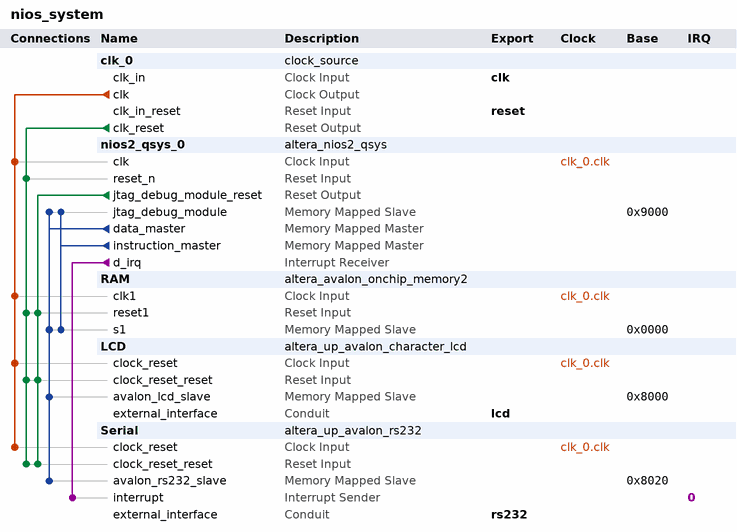
[diagram p0: system contents]
# Platform Designer (Qsys) system nios_system, Cyclone II EP2C35F672C6
# Parameters at their usual value, and those the tool derives, are not listed.
package require -exact qsys 13.0
create_system nios_system
set_project_property DEVICE_FAMILY {Cyclone II}
set_project_property DEVICE EP2C35F672C6

add_instance clk_0 clock_source 13.0
set_instance_parameter_value clk_0 clockFrequency 50000000

add_instance nios2_qsys_0 altera_nios2_qsys 13.0
set_instance_parameter_value nios2_qsys_0 resetSlave RAM.s1
set_instance_parameter_value nios2_qsys_0 mmu_TLBMissExcSlave None
set_instance_parameter_value nios2_qsys_0 exceptionSlave RAM.s1
set_instance_parameter_value nios2_qsys_0 breakSlave nios2_qsys_0.jtag_debug_module
set_instance_parameter_value nios2_qsys_0 impl Small
set_instance_parameter_value nios2_qsys_0 icache_size 4096

add_instance RAM altera_avalon_onchip_memory2 13.0.1.99.2
set_instance_parameter_value RAM dataWidth 32
set_instance_parameter_value RAM dualPort false
set_instance_parameter_value RAM initMemContent true
set_instance_parameter_value RAM initializationFileName onchip_mem.hex
set_instance_parameter_value RAM memorySize 24576

add_instance LCD altera_up_avalon_character_lcd 13.0
set_instance_parameter_value LCD cursor Normal

add_instance Serial altera_up_avalon_rs232 13.0
set_instance_parameter_value Serial baud 115200
set_instance_parameter_value Serial parity None

# connections
add_connection clk_0.clk LCD.clock_reset clock
add_connection clk_0.clk nios2_qsys_0.clk clock
add_connection clk_0.clk RAM.clk1 clock
add_connection clk_0.clk Serial.clock_reset clock
add_connection clk_0.clk_reset LCD.clock_reset_reset reset
add_connection clk_0.clk_reset nios2_qsys_0.reset_n reset
add_connection clk_0.clk_reset RAM.reset1 reset
add_connection clk_0.clk_reset Serial.clock_reset_reset reset
add_connection nios2_qsys_0.jtag_debug_module_reset LCD.clock_reset_reset reset
add_connection nios2_qsys_0.jtag_debug_module_reset RAM.reset1 reset
add_connection nios2_qsys_0.jtag_debug_module_reset Serial.clock_reset_reset reset
add_connection nios2_qsys_0.data_master LCD.avalon_lcd_slave avalon
set_connection_parameter_value nios2_qsys_0.data_master/LCD.avalon_lcd_slave baseAddress 0x8000
add_connection nios2_qsys_0.data_master nios2_qsys_0.jtag_debug_module avalon
set_connection_parameter_value nios2_qsys_0.data_master/nios2_qsys_0.jtag_debug_module baseAddress 0x9000
add_connection nios2_qsys_0.data_master RAM.s1 avalon
set_connection_parameter_value nios2_qsys_0.data_master/RAM.s1 baseAddress 0x0000
add_connection nios2_qsys_0.data_master Serial.avalon_rs232_slave avalon
set_connection_parameter_value nios2_qsys_0.data_master/Serial.avalon_rs232_slave baseAddress 0x8020
add_connection nios2_qsys_0.instruction_master nios2_qsys_0.jtag_debug_module avalon
set_connection_parameter_value nios2_qsys_0.instruction_master/nios2_qsys_0.jtag_debug_module baseAddress 0x9000
add_connection nios2_qsys_0.instruction_master RAM.s1 avalon
set_connection_parameter_value nios2_qsys_0.instruction_master/RAM.s1 baseAddress 0x0000
add_connection nios2_qsys_0.d_irq Serial.interrupt interrupt
set_connection_parameter_value nios2_qsys_0.d_irq/Serial.interrupt irqNumber 0

# exported interfaces
add_interface clk clock sink
set_interface_property clk EXPORT_OF clk_0.clk_in
add_interface reset reset sink
set_interface_property reset EXPORT_OF clk_0.clk_in_reset
add_interface rs232 conduit end
set_interface_property rs232 EXPORT_OF Serial.external_interface
add_interface lcd conduit end
set_interface_property lcd EXPORT_OF LCD.external_interface

set_interconnect_requirement {$system} qsys_mm.clockCrossingAdapter HANDSHAKE
set_interconnect_requirement {$system} qsys_mm.maxAdditionalLatency 1

save_system nios_system.qsys
